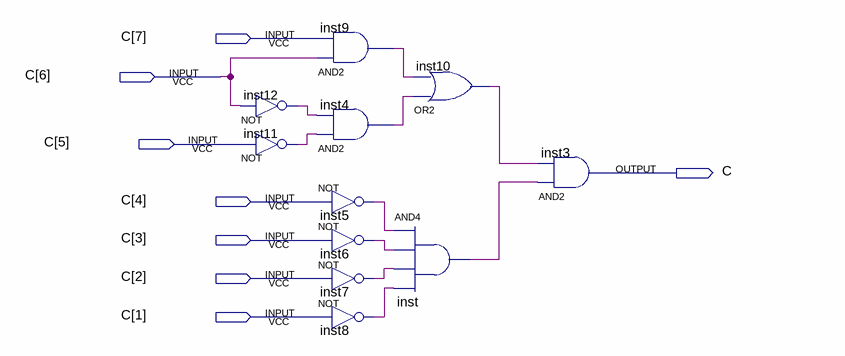
[diagram p0: schematic sheet]
// Quartus schematic cdp_c.bdf as structural Verilog: 11 symbols, 8 pins
module cdp_c (
  input  [7:1] C,
  output C_1bit
);

  wire inst4_out, inst5_out, inst6_out, inst7_out, inst8_out, inst9_out, inst10_out, inst11_out, inst12_out,
       inst_out;

  not inst12 (inst12_out, C[6]);
  not inst11 (inst11_out, C[5]);
  and inst9 (inst9_out, C[6], C[7]);
  and inst4 (inst4_out, inst11_out, inst12_out);
  not inst5 (inst5_out, C[4]);
  not inst6 (inst6_out, C[3]);
  not inst7 (inst7_out, C[2]);
  not inst8 (inst8_out, C[1]);
  or inst10 (inst10_out, inst4_out, inst9_out);
  and inst (inst_out, inst5_out, inst6_out, inst7_out, inst8_out);
  and inst3 (C_1bit, inst_out, inst10_out);
endmodule
